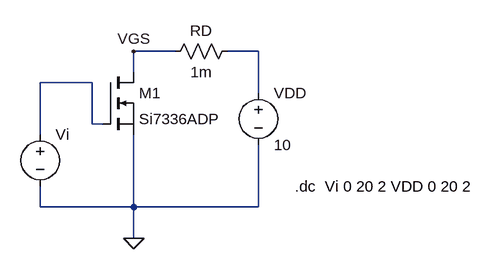
[diagram p0: schematic Draft1.asc]
Draft1.asc, the LTspice schematic file:
Version 4
SHEET 1 880 680
WIRE 256 48 192 48
WIRE 384 48 336 48
WIRE 192 80 192 48
WIRE 128 96 48 96
WIRE 384 112 384 48
WIRE 128 160 128 96
WIRE 144 160 128 160
WIRE 48 176 48 96
WIRE 48 288 48 256
WIRE 192 288 192 176
WIRE 192 288 48 288
WIRE 384 288 384 192
WIRE 384 288 192 288
WIRE 192 336 192 288
FLAG 192 336 0
FLAG 192 48 VGS
SYMBOL nmos 144 80 R0
SYMATTR InstName M1
SYMATTR Value Si7336ADP
SYMBOL voltage 48 160 R0
WINDOW 123 24 124 Left 2
WINDOW 39 0 0 Left 0
SYMATTR InstName Vi
SYMATTR Value ""
SYMBOL voltage 384 96 R0
WINDOW 123 0 0 Left 0
WINDOW 39 0 0 Left 0
SYMATTR InstName VDD
SYMATTR Value 10
SYMBOL res 352 32 R90
WINDOW 0 0 56 VBottom 2
WINDOW 3 32 56 VTop 2
SYMATTR InstName RD
SYMATTR Value 1m
TEXT 440 256 Left 2 !.dc  Vi 0 20 2 VDD 0 20 2

The netlist it stands for:
* Draft1.asc
M1 VGS N002 0 0 Si7336ADP
Vi N002 0
VDD N001 0 10
RD N001 VGS 1m
.model NMOS NMOS
.model PMOS PMOS
.lib standard.mos
.dc  Vi 0 20 2 VDD 0 20 2
.backanno
.end